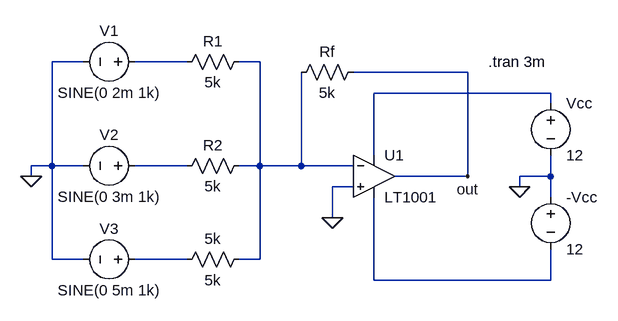
[diagram p0: schematic summing_amp.asc]
summing_amp.asc, the LTspice schematic file:
Version 4.1
SHEET 1 880 680
WIRE -272 -16 -320 -16
WIRE -112 -16 -192 -16
WIRE 0 -16 -32 -16
WIRE 320 0 144 0
WIRE 448 32 176 32
WIRE 448 48 448 32
WIRE 176 128 176 32
WIRE -320 144 -320 -16
WIRE -320 144 -352 144
WIRE -272 144 -320 144
WIRE -112 144 -192 144
WIRE 0 144 0 -16
WIRE 0 144 -32 144
WIRE 64 144 64 0
WIRE 64 144 0 144
WIRE 144 144 64 144
WIRE -352 160 -352 144
WIRE 320 160 320 0
WIRE 320 160 208 160
WIRE 448 160 448 128
WIRE 448 160 400 160
WIRE 144 176 112 176
WIRE 400 176 400 160
WIRE 448 192 448 160
WIRE 112 224 112 176
WIRE -320 288 -320 144
WIRE -272 288 -320 288
WIRE -112 288 -192 288
WIRE 0 288 0 144
WIRE 0 288 -32 288
WIRE 176 320 176 192
WIRE 448 320 448 272
WIRE 448 320 176 320
FLAG 112 224 0
FLAG 400 176 0
FLAG 320 160 out
FLAG -352 160 0
SYMBOL res 160 -16 R90
WINDOW 0 0 56 VBottom 2
WINDOW 3 32 56 VTop 2
SYMATTR InstName Rf
SYMATTR Value 5k
SYMBOL voltage 448 32 R0
WINDOW 123 0 0 Left 0
WINDOW 39 0 0 Left 0
SYMATTR InstName Vcc
SYMATTR Value 12
SYMBOL voltage 448 176 R0
WINDOW 123 0 0 Left 0
WINDOW 39 0 0 Left 0
SYMATTR InstName -Vcc
SYMATTR Value 12
SYMBOL OpAmps\\LT1001 176 96 R0
SYMATTR InstName U1
SYMBOL voltage -176 -16 R90
WINDOW 0 -32 56 VBottom 2
WINDOW 3 32 56 VTop 2
WINDOW 123 0 0 Left 0
WINDOW 39 0 0 Left 0
SYMATTR InstName V1
SYMATTR Value SINE(0 2m 1k)
SYMBOL voltage -176 144 R90
WINDOW 0 -32 56 VBottom 2
WINDOW 3 32 56 VTop 2
WINDOW 123 0 0 Left 0
WINDOW 39 0 0 Left 0
SYMATTR InstName V2
SYMATTR Value SINE(0 3m 1k)
SYMBOL voltage -176 288 R90
WINDOW 0 -32 56 VBottom 2
WINDOW 3 32 56 VTop 2
WINDOW 123 0 0 Left 0
WINDOW 39 0 0 Left 0
SYMATTR InstName V3
SYMATTR Value SINE(0 5m 1k)
SYMBOL res -16 -32 R90
WINDOW 0 0 56 VBottom 2
WINDOW 3 32 56 VTop 2
SYMATTR InstName R1
SYMATTR Value 5k
SYMBOL res -16 128 R90
WINDOW 0 0 56 VBottom 2
WINDOW 3 32 56 VTop 2
SYMATTR InstName R2
SYMATTR Value 5k
SYMBOL res -16 272 R90
WINDOW 0 0 56 VBottom 2
WINDOW 3 32 56 VTop 2
SYMATTR InstName 5k
SYMATTR Value 5k
TEXT 352 -16 Left 2 !.tran 3m

The netlist it stands for:
* summing_amp.asc
Rf out N002 5k
Vcc N003 0 12
V§-Vcc 0 N006 12
X§U1 0 N002 N003 N006 out LT1001  ; pins In+ In- V+ V- OUT
V1 N001 0 SINE(0 2m 1k)
V2 N004 0 SINE(0 3m 1k)
V3 N005 0 SINE(0 5m 1k)
R1 N002 N001 5k
R2 N002 N004 5k
R§5k N002 N005 5k
.tran 3m
.lib LTC.lib
.backanno
.end